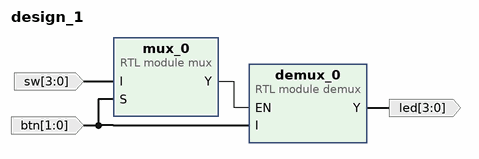
[diagram p0: block diagram of the top level]
# Vivado block design design_1, xc7z007sclg400-2, Vivado 2025.1
create_bd_design design_1

create_bd_port -dir I -from 3 -to 0 sw
create_bd_port -dir I -from 1 -to 0 btn
create_bd_port -dir O -from 3 -to 0 led

create_bd_cell -type module -reference mux mux_0
create_bd_cell -type module -reference demux demux_0

# ---- connections ----

connect_bd_net -net I_0_1 [get_bd_ports sw] [get_bd_pins mux_0/I]
connect_bd_net -net S_0_1 [get_bd_ports btn] [get_bd_pins mux_0/S] [get_bd_pins demux_0/I]
connect_bd_net [get_bd_pins demux_0/Y] [get_bd_ports led]
connect_bd_net [get_bd_pins mux_0/Y] [get_bd_pins demux_0/EN]

validate_bd_design
save_bd_design
